# EAGLE schematic NixieDriver (EAGLE 9.2.2)

## Sheet 1 of 3: SR and BCD
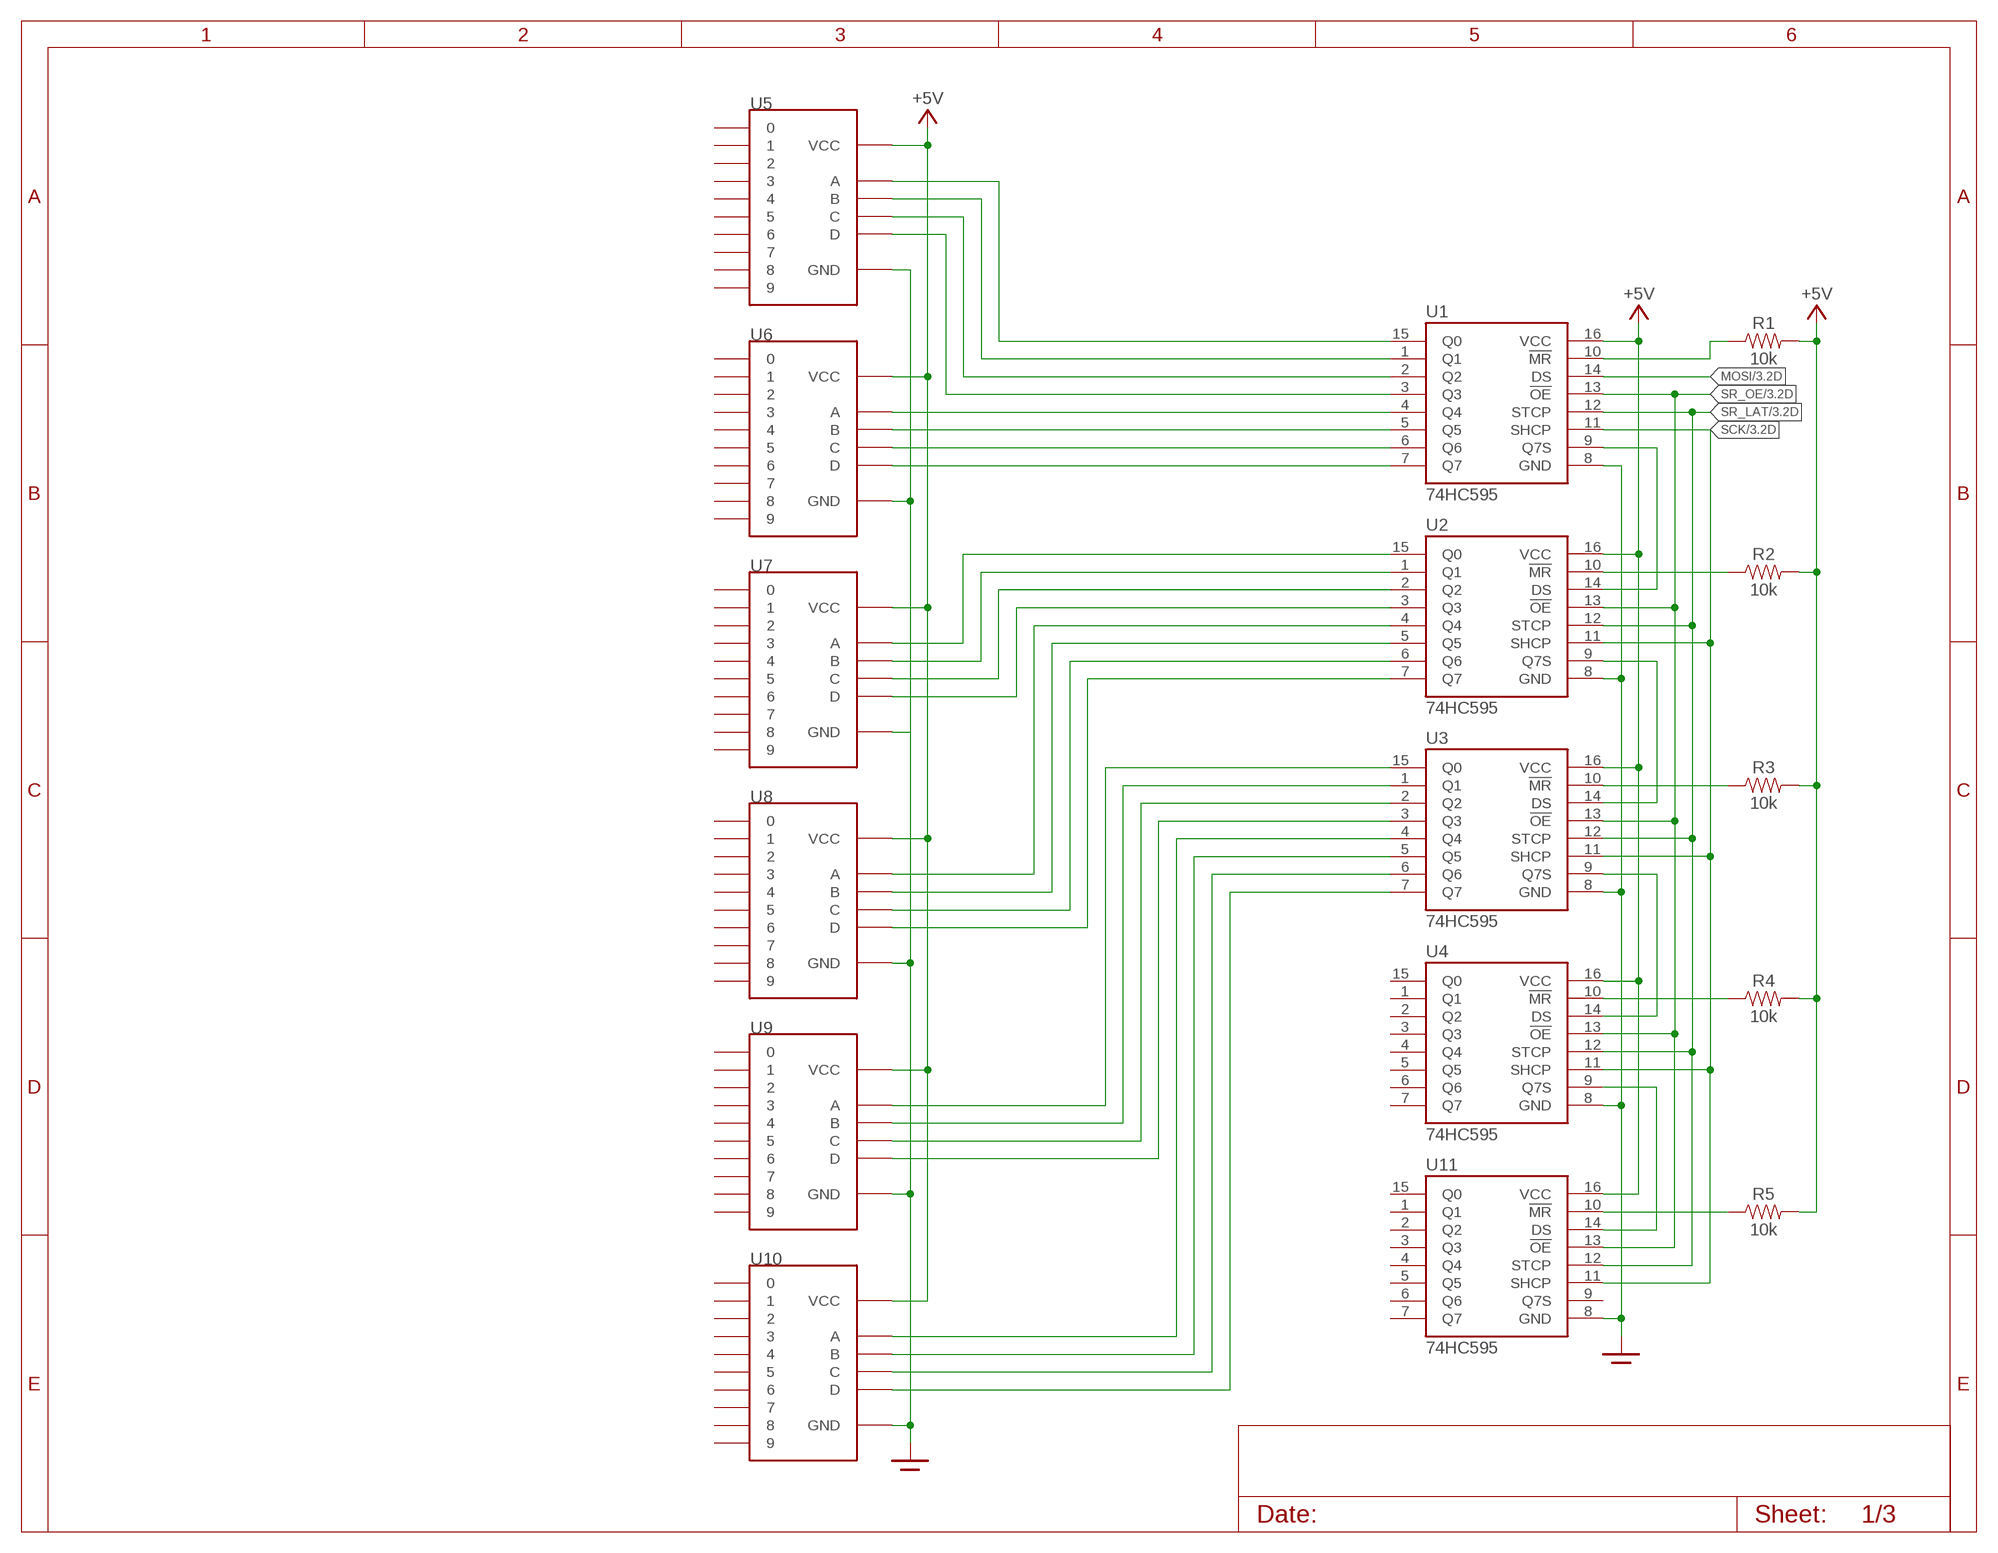
[diagram p0: schematic, sheet 1]

### Parts
R1  10k  RESISTOR0805  [SMD-805]
R2  10k  RESISTOR0805  [SMD-805]
R3  10k  RESISTOR0805  [SMD-805]
R4  10k  RESISTOR0805  [SMD-805]
R5  10k  RESISTOR0805  [SMD-805]
U1  74HC595  [TSSOP-16]
U2  74HC595  [TSSOP-16]
U3  74HC595  [TSSOP-16]
U4  74HC595  [TSSOP-16]
U5  74HC42  [SOIC-16]
U6  74HC42  [SOIC-16]
U7  74HC42  [SOIC-16]
U8  74HC42  [SOIC-16]
U9  74HC42  [SOIC-16]
U10  74HC42  [SOIC-16]
U11  74HC595  [TSSOP-16]

### Nets
+5V: R1.2 R2.2 R3.2 R4.2 R5.2 U1.16(VCC) U2.16(VCC) U3.16(VCC) U4.16(VCC) U5.16(VCC) U6.16(VCC) U7.16(VCC) U8.16(VCC) U9.16(VCC) U10.16(VCC) U11.16(VCC) ; also sheet 3
GND: U1.8(GND) U2.8(GND) U3.8(GND) U4.8(GND) U5.8(GND) U6.8(GND) U7.8(GND) U8.8(GND) U9.8(GND) U10.8(GND) U11.8(GND) ; also sheet 2,3
MOSI: U1.14(DS) ; also sheet 3
N$1: R1.1 U1.10(!MR)
N$2: R2.1 U2.10(!MR)
N$5: U1.15(Q0) U5.15(A)
N$6: U1.9(Q7S) U2.14(DS)
N$7: U2.9(Q7S) U3.14(DS)
N$8: U3.9(Q7S) U4.14(DS)
N$9: R3.1 U3.10(!MR)
N$10: R4.1 U4.10(!MR)
N$11: U1.1(Q1) U5.14(B)
N$12: U1.2(Q2) U5.13(C)
N$13: U1.3(Q3) U5.12(D)
N$14: U1.4(Q4) U6.15(A)
N$15: U1.5(Q5) U6.14(B)
N$16: U1.6(Q6) U6.13(C)
N$17: U1.7(Q7) U6.12(D)
N$18: U2.15(Q0) U7.15(A)
N$19: U2.1(Q1) U7.14(B)
N$20: U2.2(Q2) U7.13(C)
N$21: U2.3(Q3) U7.12(D)
N$22: U2.4(Q4) U8.15(A)
N$23: U2.5(Q5) U8.14(B)
N$24: U2.6(Q6) U8.13(C)
N$25: U2.7(Q7) U8.12(D)
N$26: U3.15(Q0) U9.15(A)
N$27: U3.1(Q1) U9.14(B)
N$28: U3.2(Q2) U9.13(C)
N$29: U3.3(Q3) U9.12(D)
N$30: U3.4(Q4) U10.15(A)
N$31: U3.5(Q5) U10.14(B)
N$32: U3.6(Q6) U10.13(C)
N$33: U3.7(Q7) U10.12(D)
N$44: R5.1 U11.10(!MR)
N$59: U4.9(Q7S) U11.14(DS)
SCK: U1.11(SHCP) U2.11(SHCP) U3.11(SHCP) U4.11(SHCP) U11.11(SHCP) ; also sheet 3
SR_LAT: U1.12(STCP) U2.12(STCP) U3.12(STCP) U4.12(STCP) U11.12(STCP) ; also sheet 3
SR_OE: U1.13(!OE) U2.13(!OE) U3.13(!OE) U4.13(!OE) U11.13(!OE) ; also sheet 3
Unconnected: U4.1(Q1) U4.2(Q2) U4.3(Q3) U4.4(Q4) U4.5(Q5) U4.6(Q6) U4.7(Q7) U4.15(Q0) U5.1 U5.2 U5.3 U5.4 U5.5 U5.6 U5.7 U5.9 U5.10 U5.11 U6.1 U6.2 U6.3 U6.4 U6.5 U6.6 U6.7 U6.9 U6.10 U6.11 U7.1 U7.2 U7.3 U7.4 U7.5 U7.6 U7.7 U7.9 U7.10 U7.11 U8.1 U8.2 U8.3 U8.4 U8.5 U8.6 U8.7 U8.9 U8.10 U8.11 U9.1 U9.2 U9.3 U9.4 U9.5 U9.6 U9.7 U9.9 U9.10 U9.11 U10.1 U10.2 U10.3 U10.4 U10.5 U10.6 U10.7 U10.9 U10.10 U10.11 U11.1(Q1) U11.2(Q2) U11.3(Q3) U11.4(Q4) U11.5(Q5) U11.6(Q6) U11.7(Q7) U11.9(Q7S) U11.15(Q0)

## Sheet 2 of 3: Nixie Tubes and Driver
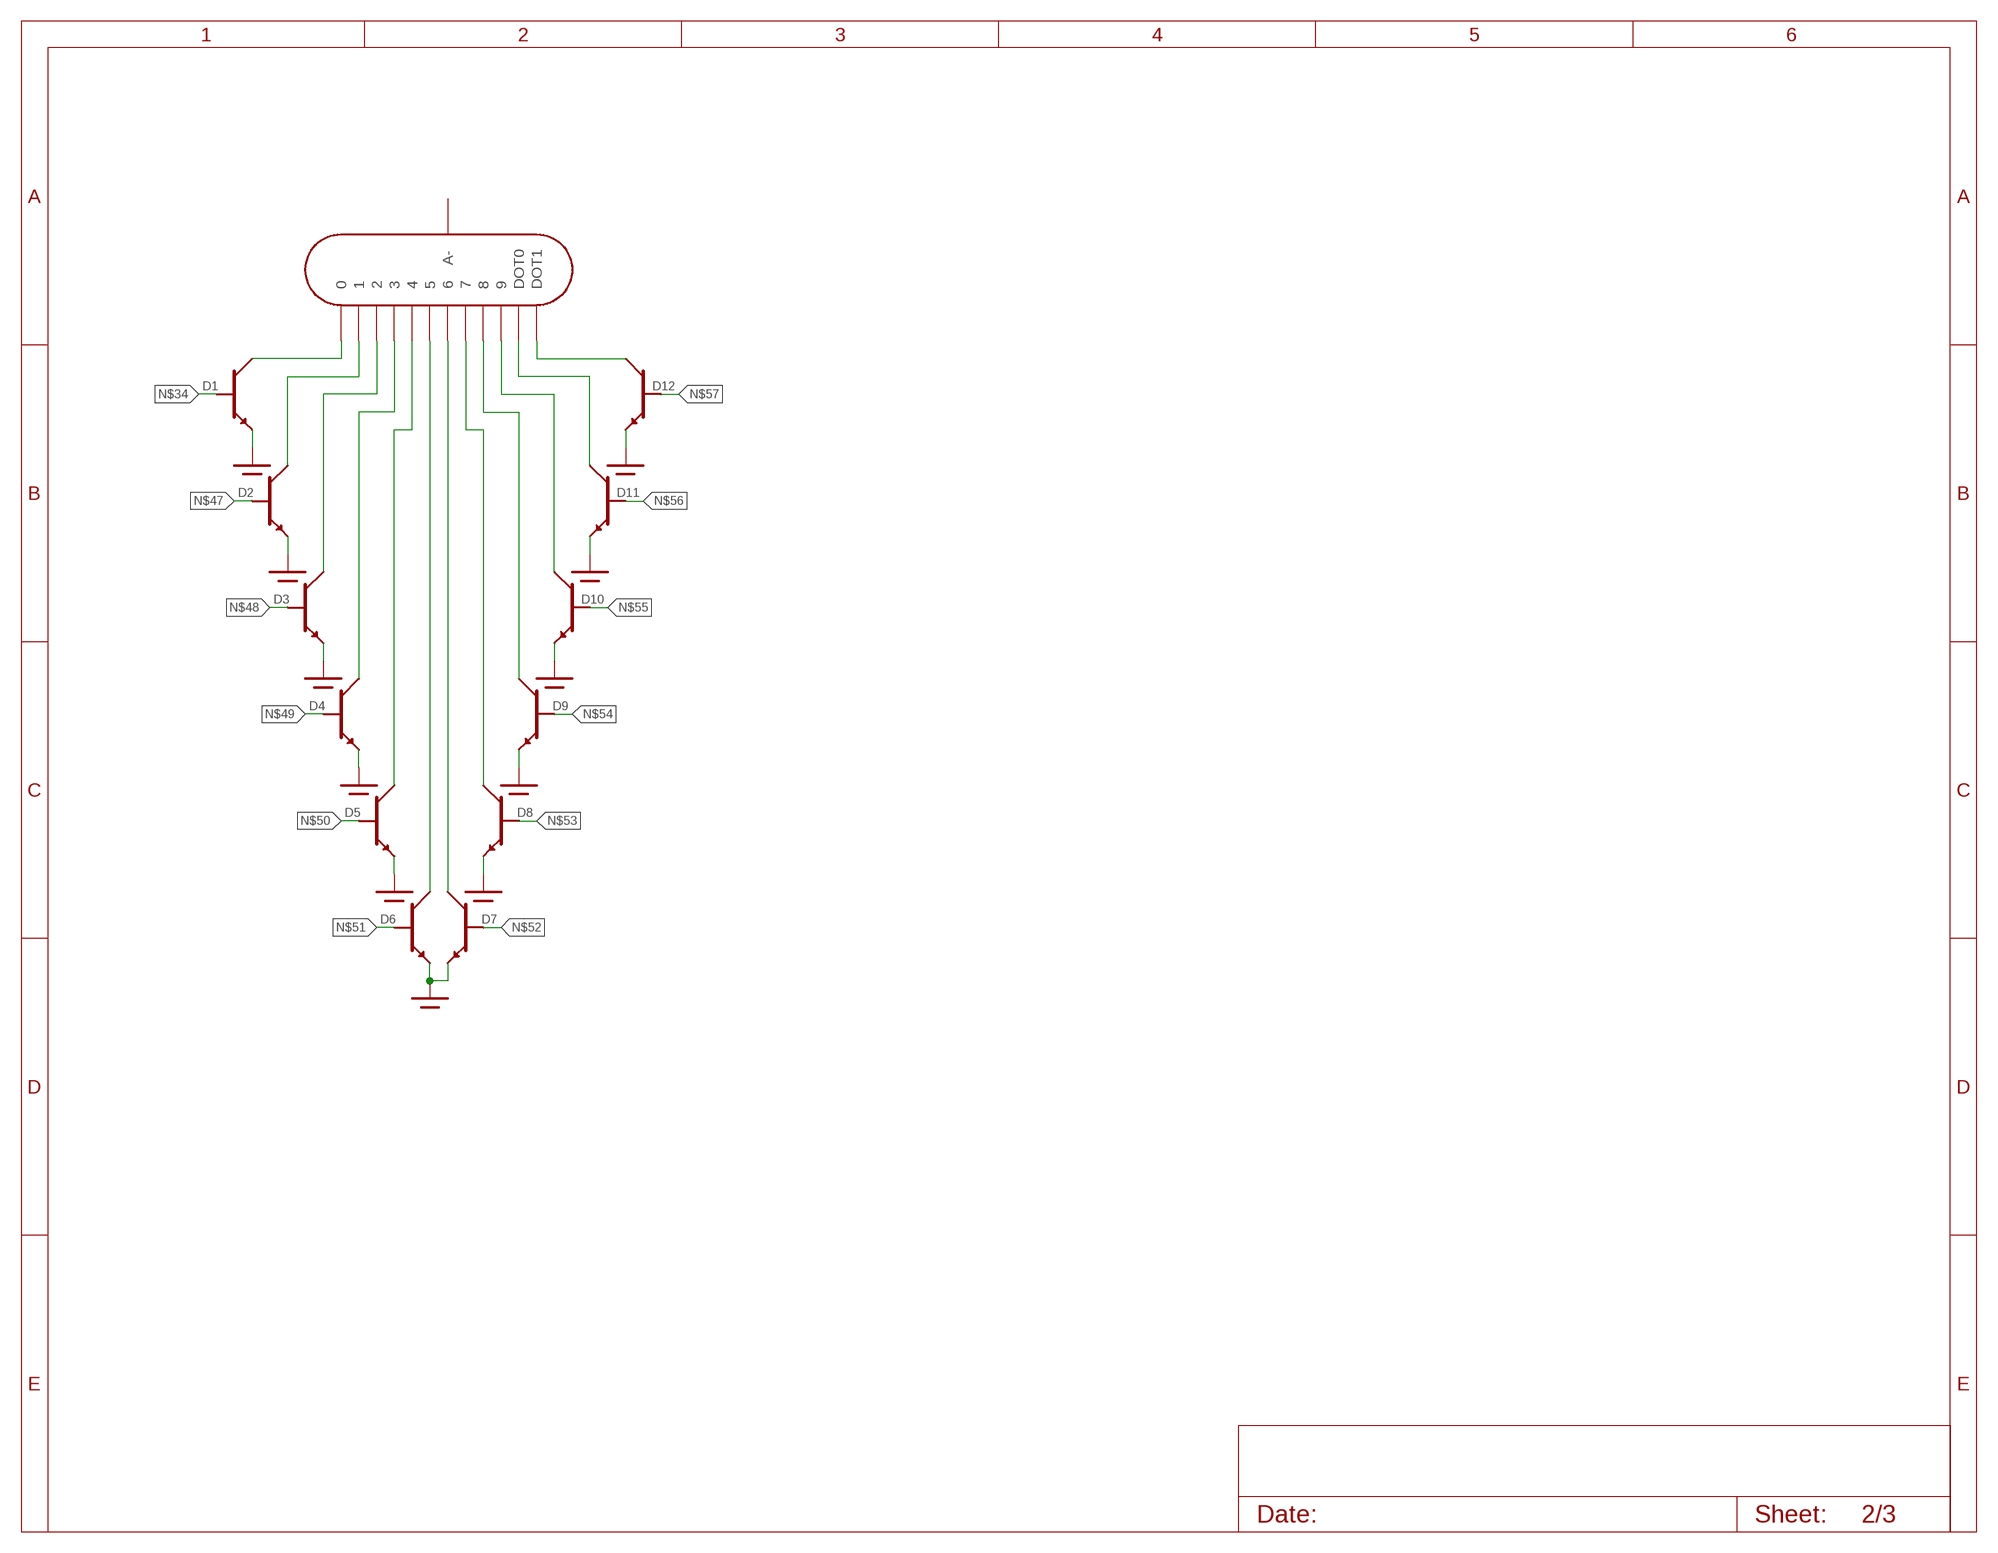
[diagram p1: schematic, sheet 2]

### Parts
D1  BJT-NPN  [SOT-23-3]
D2  BJT-NPN  [SOT-23-3]
D3  BJT-NPN  [SOT-23-3]
D4  BJT-NPN  [SOT-23-3]
D5  BJT-NPN  [SOT-23-3]
D6  BJT-NPN  [SOT-23-3]
D7  BJT-NPN  [SOT-23-3]
D8  BJT-NPN  [SOT-23-3]
D9  BJT-NPN  [SOT-23-3]
D10  BJT-NPN  [SOT-23-3]
D11  BJT-NPN  [SOT-23-3]
D12  BJT-NPN  [SOT-23-3]
N1  IN-16-NIXIE  [IN-16-NIXIE]

### Nets
GND: D1.2 D2.2 D3.2 D4.2 D5.2 D6.2 D7.2 D8.2 D9.2 D10.2 D11.2 D12.2 ; also sheet 1,3
N$3: D1.1 N1.1
N$4: D2.1 N1.2
N$34: D1.3
N$35: D3.1 N1.3
N$36: D4.1 N1.4
N$37: D5.1 N1.5
N$38: D6.1 N1.6
N$39: D7.1 N1.7
N$41: D8.1 N1.8
N$42: D9.1 N1.9
N$43: D10.1 N1.10
N$45: D11.1 N1.12(DOT0)
N$46: D12.1 N1.13(DOT1)
N$47: D2.3
N$48: D3.3
N$49: D4.3
N$50: D5.3
N$51: D6.3
N$52: D7.3
N$53: D8.3
N$54: D9.3
N$55: D10.3
N$56: D11.3
N$57: D12.3
Unconnected: N1.11(A-)

## Sheet 3 of 3
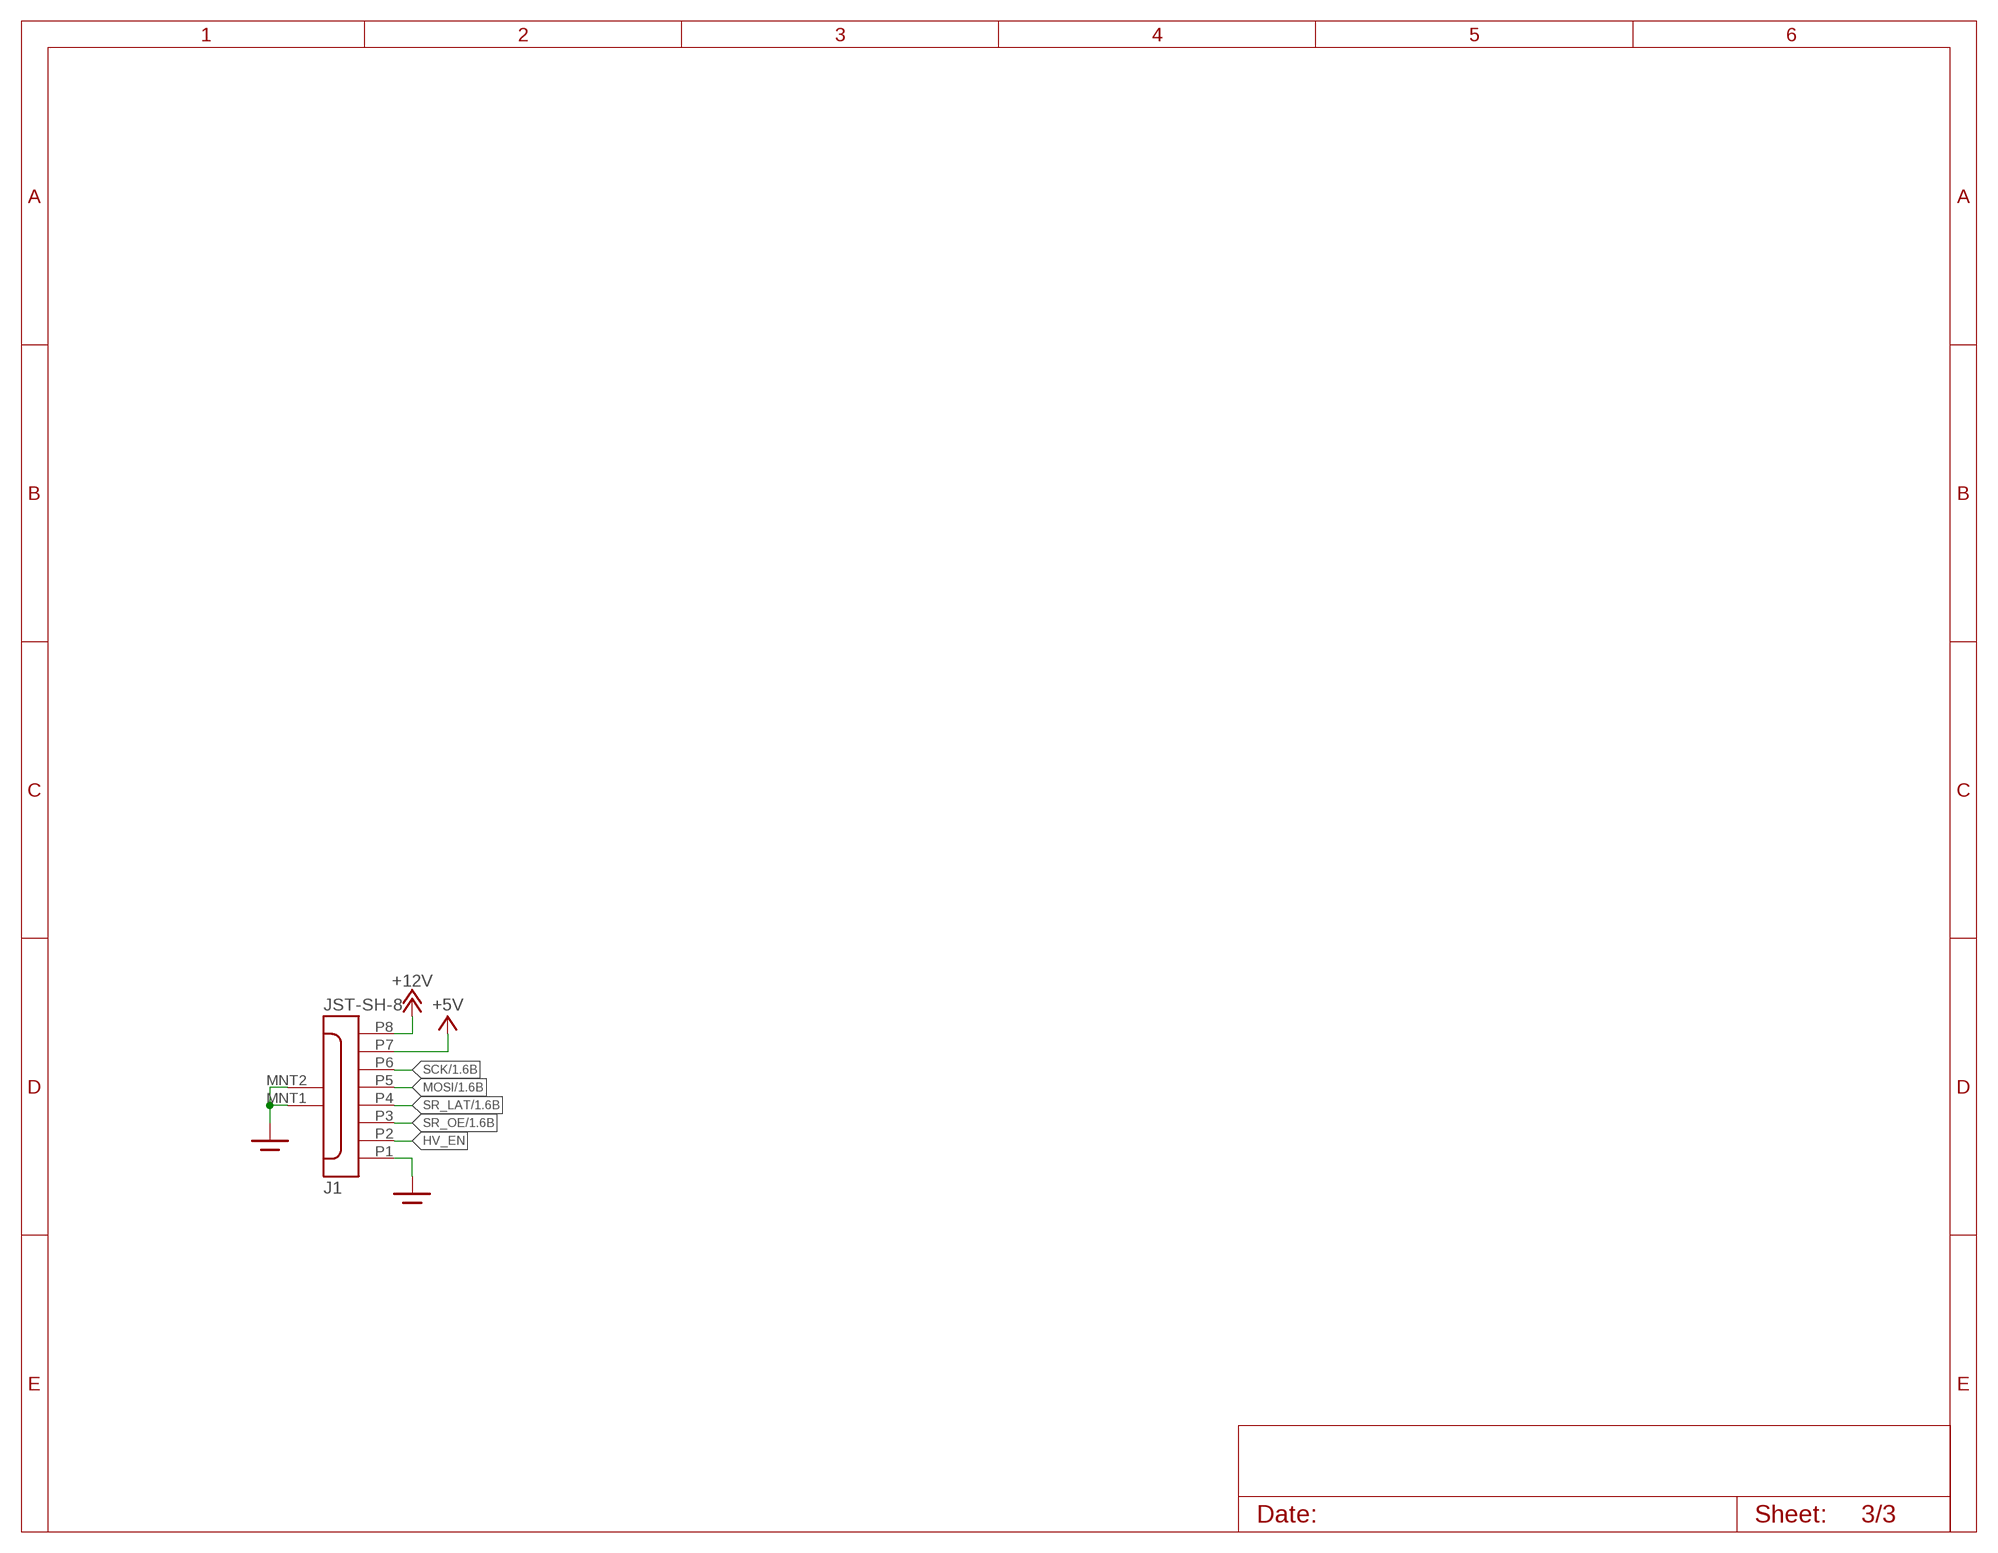
[diagram p2: schematic, sheet 3]

### Parts
J1  JST-SH-8  [JST-SH-8]

### Nets
+5V: J1.P7 ; also sheet 1
+12V: J1.P8
GND: J1.MNT1 J1.MNT2 J1.P1 ; also sheet 1,2
HV_EN: J1.P2
MOSI: J1.P5 ; also sheet 1
SCK: J1.P6 ; also sheet 1
SR_LAT: J1.P4 ; also sheet 1
SR_OE: J1.P3 ; also sheet 1

## Library data of the parts
D1-D12 = NixieDisplay:BJT-NPN
J1 = NixieDisplay:JST-SH-8
N1 = NixieDisplay:IN-16-NIXIE: Large Nixie Tube with 0-9 digits and two dots
R1-R5 = NixieDisplay:RESISTOR
U1-U4 U11 = NixieDisplay:74HC595: 8 Output Shift Register
U5-U10 = NixieDisplay:74HC42: BCD to Decimal Converter